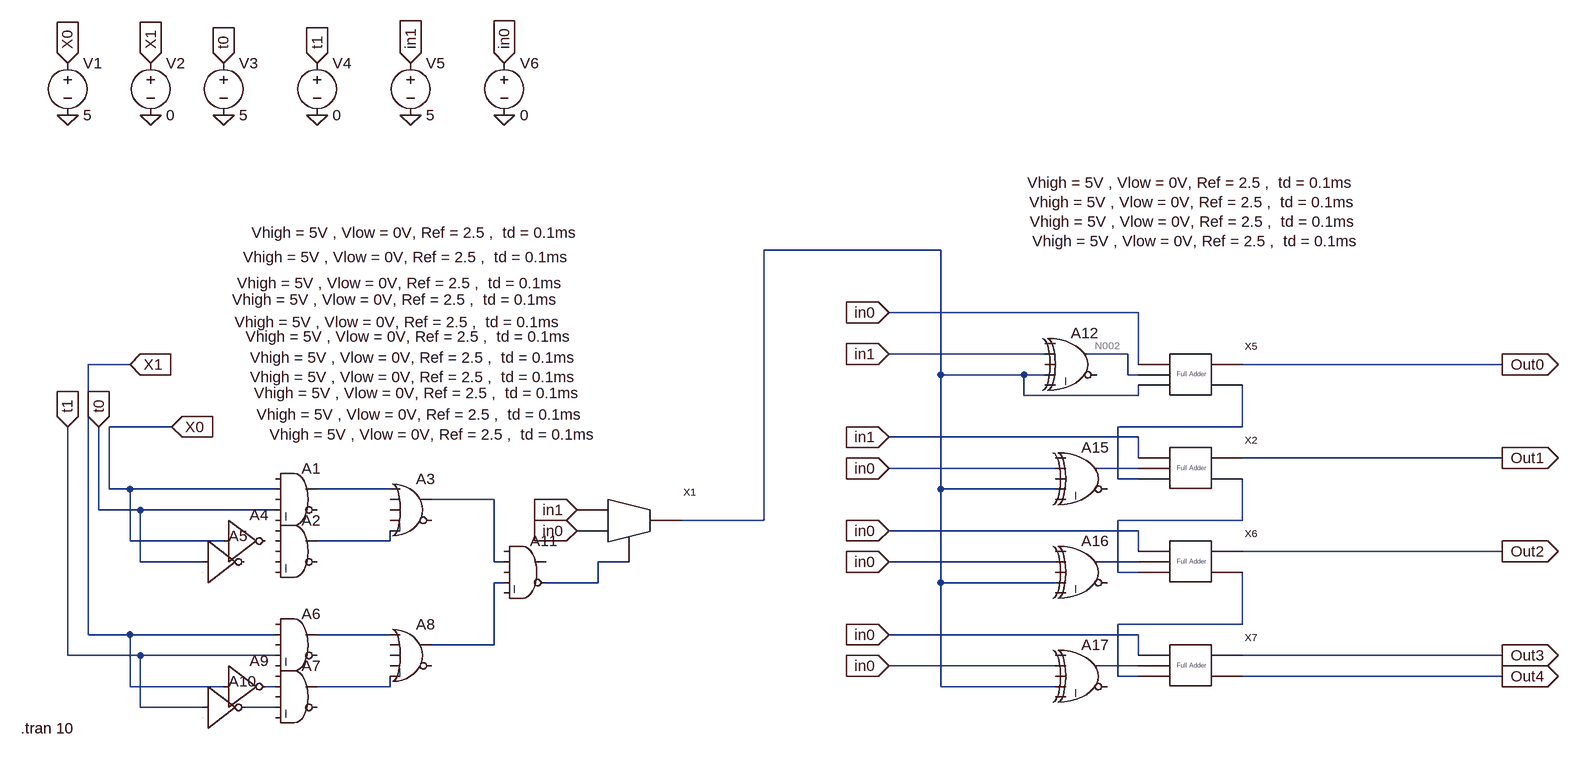
[diagram p0: schematic perceptron.asc]
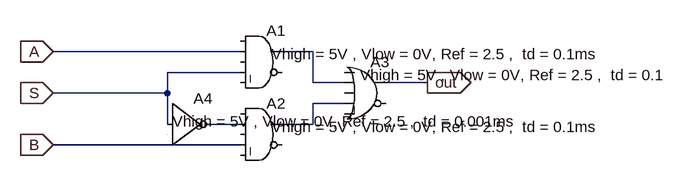
[diagram p1: sub-circuit 2_1_mux.asc]
perceptron.asc, the LTspice schematic file:
Version 4
SHEET 1 3876 1460
WIRE 944 -160 672 -160
WIRE 1248 -64 864 -64
WIRE 1104 0 864 0
WIRE 1232 0 1168 0
WIRE -304 16 -368 16
WIRE 1248 16 1248 -64
WIRE 1808 16 1408 16
WIRE 944 32 944 -160
WIRE 1072 32 944 32
WIRE 1104 32 1072 32
WIRE 1232 32 1232 0
WIRE 1248 32 1232 32
WIRE 1072 64 1072 32
WIRE 1248 64 1248 48
WIRE 1248 64 1072 64
WIRE -240 112 -336 112
WIRE 1408 112 1408 48
WIRE 1408 112 1216 112
WIRE 1248 128 864 128
WIRE 1248 160 1248 128
WIRE 1808 160 1408 160
WIRE 1120 176 864 176
WIRE 1248 176 1184 176
WIRE 1216 192 1216 112
WIRE 1248 192 1216 192
WIRE -336 208 -336 112
WIRE -304 208 -336 208
WIRE -80 208 -304 208
WIRE 96 208 -16 208
WIRE 944 208 944 32
WIRE 1120 208 944 208
WIRE 256 224 160 224
WIRE -352 240 -352 112
WIRE -288 240 -352 240
WIRE -80 240 -288 240
WIRE 672 256 672 -160
WIRE 672 256 544 256
WIRE 1408 256 1408 192
WIRE 1408 256 1216 256
WIRE 1248 272 864 272
WIRE -304 288 -304 208
WIRE -160 288 -304 288
WIRE 96 288 96 272
WIRE 96 288 -16 288
WIRE 1248 304 1248 272
WIRE 1808 304 1408 304
WIRE -288 320 -288 240
WIRE -192 320 -288 320
WIRE 256 320 256 224
WIRE 272 320 256 320
WIRE 464 320 416 320
WIRE 1120 320 864 320
WIRE 1248 320 1184 320
WIRE 1216 336 1216 256
WIRE 1248 336 1216 336
WIRE 272 352 256 352
WIRE 416 352 416 320
WIRE 416 352 336 352
WIRE 944 352 944 208
WIRE 1120 352 944 352
WIRE 1408 416 1408 336
WIRE 1408 416 1216 416
WIRE -368 432 -368 16
WIRE -304 432 -368 432
WIRE -80 432 -304 432
WIRE 96 432 -16 432
WIRE 1248 432 864 432
WIRE 256 448 256 352
WIRE 256 448 160 448
WIRE -400 464 -400 112
WIRE -288 464 -400 464
WIRE -80 464 -288 464
WIRE 1248 464 1248 432
WIRE 1808 464 1408 464
WIRE 1120 480 864 480
WIRE 1248 480 1184 480
WIRE 1216 496 1216 416
WIRE 1248 496 1216 496
WIRE 1808 496 1408 496
WIRE -304 512 -304 432
WIRE -160 512 -304 512
WIRE -80 512 -96 512
WIRE 96 512 96 496
WIRE 96 512 -16 512
WIRE 944 512 944 352
WIRE 1120 512 944 512
WIRE -288 544 -288 464
WIRE -192 544 -288 544
WIRE -80 544 -128 544
FLAG -240 112 X0
IOPIN -240 112 In
FLAG -352 112 t0
IOPIN -352 112 In
FLAG -304 16 X1
IOPIN -304 16 In
FLAG -400 112 t1
IOPIN -400 112 In
FLAG 128 -448 in1
IOPIN 128 -448 In
FLAG 272 -448 in0
IOPIN 272 -448 In
FLAG 384 272 in0
IOPIN 384 272 In
FLAG 384 240 in1
IOPIN 384 240 In
FLAG -400 -448 X0
IOPIN -400 -448 In
FLAG -272 -448 X1
IOPIN -272 -448 In
FLAG -160 -448 t0
IOPIN -160 -448 In
FLAG -16 -448 t1
IOPIN -16 -448 In
FLAG 864 -64 in0
IOPIN 864 -64 In
FLAG 864 272 in0
IOPIN 864 272 In
FLAG 864 432 in0
IOPIN 864 432 In
FLAG 864 176 in0
IOPIN 864 176 In
FLAG 864 320 in0
IOPIN 864 320 In
FLAG 864 480 in0
IOPIN 864 480 In
FLAG 864 0 in1
IOPIN 864 0 In
FLAG 864 128 in1
IOPIN 864 128 In
FLAG -400 -368 0
FLAG -272 -368 0
FLAG -160 -368 0
FLAG -16 -368 0
FLAG 128 -368 0
FLAG 272 -368 0
FLAG 1808 16 Out0
IOPIN 1808 16 Out
FLAG 1808 160 Out1
IOPIN 1808 160 Out
FLAG 1808 304 Out2
IOPIN 1808 304 Out
FLAG 1808 464 Out3
IOPIN 1808 464 Out
FLAG 1808 496 Out4
IOPIN 1808 496 Out
SYMBOL 2_1_mux 448 256 R0
SYMATTR InstName X1
SYMBOL Digital\\and -48 160 R0
WINDOW 3 -65 -100 Left 2
SYMATTR Value Vhigh = 5V , Vlow = 0V, Ref = 2.5 ,  td = 0.1ms
SYMATTR InstName A1
SYMBOL Digital\\and -48 240 R0
WINDOW 3 -71 -205 Left 2
SYMATTR Value Vhigh = 5V , Vlow = 0V, Ref = 2.5 ,  td = 0.1ms
SYMATTR InstName A2
SYMBOL Digital\\or 128 176 R0
WINDOW 3 -267 -285 Left 2
SYMATTR Value Vhigh = 5V , Vlow = 0V, Ref = 2.5 ,  td = 0.1ms
SYMATTR InstName A3
SYMBOL Digital\\inv -160 224 R0
WINDOW 3 51 -131 Left 2
SYMATTR Value Vhigh = 5V , Vlow = 0V, Ref = 2.5 ,  td = 0.1ms
SYMATTR InstName A4
SYMBOL Digital\\inv -192 256 R0
WINDOW 3 73 -251 Left 2
SYMATTR Value Vhigh = 5V , Vlow = 0V, Ref = 2.5 ,  td = 0.1ms
SYMATTR InstName A5
SYMBOL Digital\\and -48 384 R0
WINDOW 3 -78 -411 Left 2
SYMATTR Value Vhigh = 5V , Vlow = 0V, Ref = 2.5 ,  td = 0.1ms
SYMATTR InstName A6
SYMBOL Digital\\and -48 464 R0
WINDOW 3 -99 -548 Left 2
SYMATTR Value Vhigh = 5V , Vlow = 0V, Ref = 2.5 ,  td = 0.1ms
SYMATTR InstName A7
SYMBOL Digital\\or 128 400 R0
WINDOW 3 -245 -587 Left 2
SYMATTR Value Vhigh = 5V , Vlow = 0V, Ref = 2.5 ,  td = 0.1ms
SYMATTR InstName A8
SYMBOL Digital\\inv -160 448 R0
WINDOW 3 71 -324 Left 2
SYMATTR Value Vhigh = 5V , Vlow = 0V, Ref = 2.5 ,  td = 0.1ms
SYMATTR InstName A9
SYMBOL Digital\\inv -192 480 R0
WINDOW 3 49 -529 Left 2
SYMATTR Value Vhigh = 5V , Vlow = 0V, Ref = 2.5 ,  td = 0.1ms
SYMATTR InstName A10
SYMBOL Digital\\and 304 272 R0
WINDOW 3 -434 -421 Left 2
SYMATTR Value Vhigh = 5V , Vlow = 0V, Ref = 2.5 ,  td = 0.1ms
SYMATTR InstName A11
SYMBOL full_adder 1328 176 R0
SYMATTR InstName X2
SYMBOL full_adder 1328 32 R0
SYMATTR InstName X5
SYMBOL Digital\\xor 1152 -48 R0
WINDOW 3 -75 -216 Left 2
SYMATTR Value Vhigh = 5V , Vlow = 0V, Ref = 2.5 ,  td = 0.1ms
SYMATTR InstName A12
SYMBOL Digital\\xor 1168 128 R0
WINDOW 3 -88 -362 Left 2
SYMATTR Value Vhigh = 5V , Vlow = 0V, Ref = 2.5 ,  td = 0.1ms
SYMATTR InstName A15
SYMBOL full_adder 1328 320 R0
SYMATTR InstName X6
SYMBOL Digital\\xor 1168 272 R0
WINDOW 3 -87 -476 Left 2
SYMATTR Value Vhigh = 5V , Vlow = 0V, Ref = 2.5 ,  td = 0.1ms
SYMATTR InstName A16
SYMBOL full_adder 1328 480 R0
SYMATTR InstName X7
SYMBOL Digital\\xor 1168 432 R0
WINDOW 3 -83 -606 Left 2
SYMATTR Value Vhigh = 5V , Vlow = 0V, Ref = 2.5 ,  td = 0.1ms
SYMATTR InstName A17
SYMBOL voltage -400 -464 R0
WINDOW 123 0 0 Left 0
WINDOW 39 0 0 Left 0
SYMATTR InstName V1
SYMATTR Value 5
SYMBOL voltage -272 -464 R0
WINDOW 123 0 0 Left 0
WINDOW 39 0 0 Left 0
SYMATTR InstName V2
SYMATTR Value 0
SYMBOL voltage -160 -464 R0
WINDOW 123 0 0 Left 0
WINDOW 39 0 0 Left 0
SYMATTR InstName V3
SYMATTR Value 5
SYMBOL voltage -16 -464 R0
WINDOW 123 0 0 Left 0
WINDOW 39 0 0 Left 0
SYMATTR InstName V4
SYMATTR Value 0
SYMBOL voltage 128 -464 R0
WINDOW 123 0 0 Left 0
WINDOW 39 0 0 Left 0
SYMATTR InstName V5
SYMATTR Value 5
SYMBOL voltage 272 -464 R0
WINDOW 123 0 0 Left 0
WINDOW 39 0 0 Left 0
SYMATTR InstName V6
SYMATTR Value 0
TEXT -472 576 Left 2 !.tran 10

2_1_mux.asc, the sub-circuit schematic file:
Version 4
SHEET 1 880 840
WIRE 160 80 -128 80
WIRE 272 80 224 80
WIRE 160 112 48 112
WIRE 272 128 272 80
WIRE 320 128 272 128
WIRE 448 128 384 128
WIRE 48 144 48 112
WIRE 48 144 -128 144
WIRE 320 160 272 160
WIRE 48 192 48 144
WIRE 160 192 112 192
WIRE 272 192 272 160
WIRE 272 192 224 192
WIRE 160 224 -128 224
FLAG 448 128 out
IOPIN 448 128 Out
FLAG -128 80 A
IOPIN -128 80 In
FLAG -128 144 S
IOPIN -128 144 In
FLAG -128 224 B
IOPIN -128 224 In
SYMBOL Digital\\and 192 32 R0
WINDOW 3 16 52 Left 2
SYMATTR InstName A1
SYMATTR Value Vhigh = 5V , Vlow = 0V, Ref = 2.5 ,  td = 0.1ms
SYMBOL Digital\\and 192 144 R0
WINDOW 3 16 52 Left 2
SYMATTR InstName A2
SYMATTR Value Vhigh = 5V , Vlow = 0V, Ref = 2.5 ,  td = 0.1ms
SYMBOL Digital\\or 352 80 R0
WINDOW 3 -8 36 Left 2
SYMATTR InstName A3
SYMATTR Value Vhigh = 5V , Vlow = 0V, Ref = 2.5 ,  td = 0.1
SYMBOL Digital\\inv 48 128 R0
WINDOW 3 8 60 Left 2
SYMATTR InstName A4
SYMATTR Value Vhigh = 5V , Vlow = 0V, Ref = 2.5 ,  td = 0.001ms

The netlist it stands for:
* perceptron.asc
XX1 in1 in0 N009 N001 2_1_mux
A1 0 X0 0 t0 0 0 N005 0 AND Vhigh = 5V , Vlow = 0V, Ref = 2.5 ,  td = 0.1ms
A2 0 0 0 0 0 0 N008 0 AND Vhigh = 5V , Vlow = 0V, Ref = 2.5 ,  td = 0.1ms
A3 N005 0 0 0 N008 0 N006 0 OR Vhigh = 5V , Vlow = 0V, Ref = 2.5 ,  td = 0.1ms
A4 X0 0 0 0 0 0 0 0 BUF Vhigh = 5V , Vlow = 0V, Ref = 2.5 ,  td = 0.1ms
A5 t0 0 0 0 0 0 0 0 BUF Vhigh = 5V , Vlow = 0V, Ref = 2.5 ,  td = 0.1ms
A6 0 X1 0 t1 0 0 N013 0 AND Vhigh = 5V , Vlow = 0V, Ref = 2.5 ,  td = 0.1ms
A7 0 N015 0 N017 0 0 N016 0 AND Vhigh = 5V , Vlow = 0V, Ref = 2.5 ,  td = 0.1ms
A8 N013 0 0 0 N016 0 N011 0 OR Vhigh = 5V , Vlow = 0V, Ref = 2.5 ,  td = 0.1ms
A9 X1 0 0 0 0 N015 0 0 BUF Vhigh = 5V , Vlow = 0V, Ref = 2.5 ,  td = 0.1ms
A10 t1 0 0 0 0 N017 0 0 BUF Vhigh = 5V , Vlow = 0V, Ref = 2.5 ,  td = 0.1ms
A11 0 N006 0 N011 0 N009 0 0 AND Vhigh = 5V , Vlow = 0V, Ref = 2.5 ,  td = 0.1ms
XX2 in1 N004 N003 N007 Out1 full_adder  ; pins A B Cin Cout Sum
XX5 in0 N002 N001 N003 Out0 full_adder  ; pins A B Cin Cout Sum
A12 0 in1 0 N001 0 0 N002 0 XOR Vhigh = 5V , Vlow = 0V, Ref = 2.5 ,  td = 0.1ms
A15 0 in0 0 N001 0 0 N004 0 XOR Vhigh = 5V , Vlow = 0V, Ref = 2.5 ,  td = 0.1ms
XX6 in0 N010 N007 N012 Out2 full_adder  ; pins A B Cin Cout Sum
A16 0 in0 0 N001 0 0 N010 0 XOR Vhigh = 5V , Vlow = 0V, Ref = 2.5 ,  td = 0.1ms
XX7 in0 N014 N012 Out4 Out3 full_adder  ; pins A B Cin Cout Sum
A17 0 in0 0 N001 0 0 N014 0 XOR Vhigh = 5V , Vlow = 0V, Ref = 2.5 ,  td = 0.1ms
V1 X0 0 5
V2 X1 0 0
V3 t0 0 5
V4 t1 0 0
V5 in1 0 5
V6 in0 0 0

* block symbol definitions
.subckt 2_1_mux A B S out
A1 0 A 0 S 0 0 N001 0 AND Vhigh = 5V , Vlow = 0V, Ref = 2.5 ,  td = 0.1ms
A2 0 N003 0 B 0 0 N002 0 AND Vhigh = 5V , Vlow = 0V, Ref = 2.5 ,  td = 0.1ms
A3 0 N001 0 N002 0 0 out 0 OR Vhigh = 5V , Vlow = 0V, Ref = 2.5 ,  td = 0.1
A4 S 0 0 0 0 N003 0 0 BUF Vhigh = 5V , Vlow = 0V, Ref = 2.5 ,  td = 0.001ms
.ends 2_1_mux

.tran 10
.backanno
.end

* Results of the author's LTspice run, read from the files saved beside the schematic
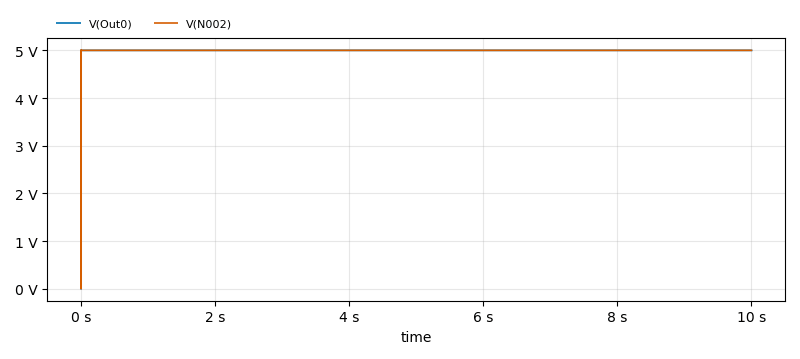
[diagram p2: Transient Analysis of perceptron.asc, plotted from the saved traces]
* Transient Analysis, 1 run:
*   V(Out0): min 0 V, max 5 V, average 5 V, rms 5 V, last 5 V
*   V(N002): min 0 V, max 5 V, average 5 V, rms 5 V, last 5 V